# Altium schematic sheet HW_ITC_LE.SchDoc
size A2
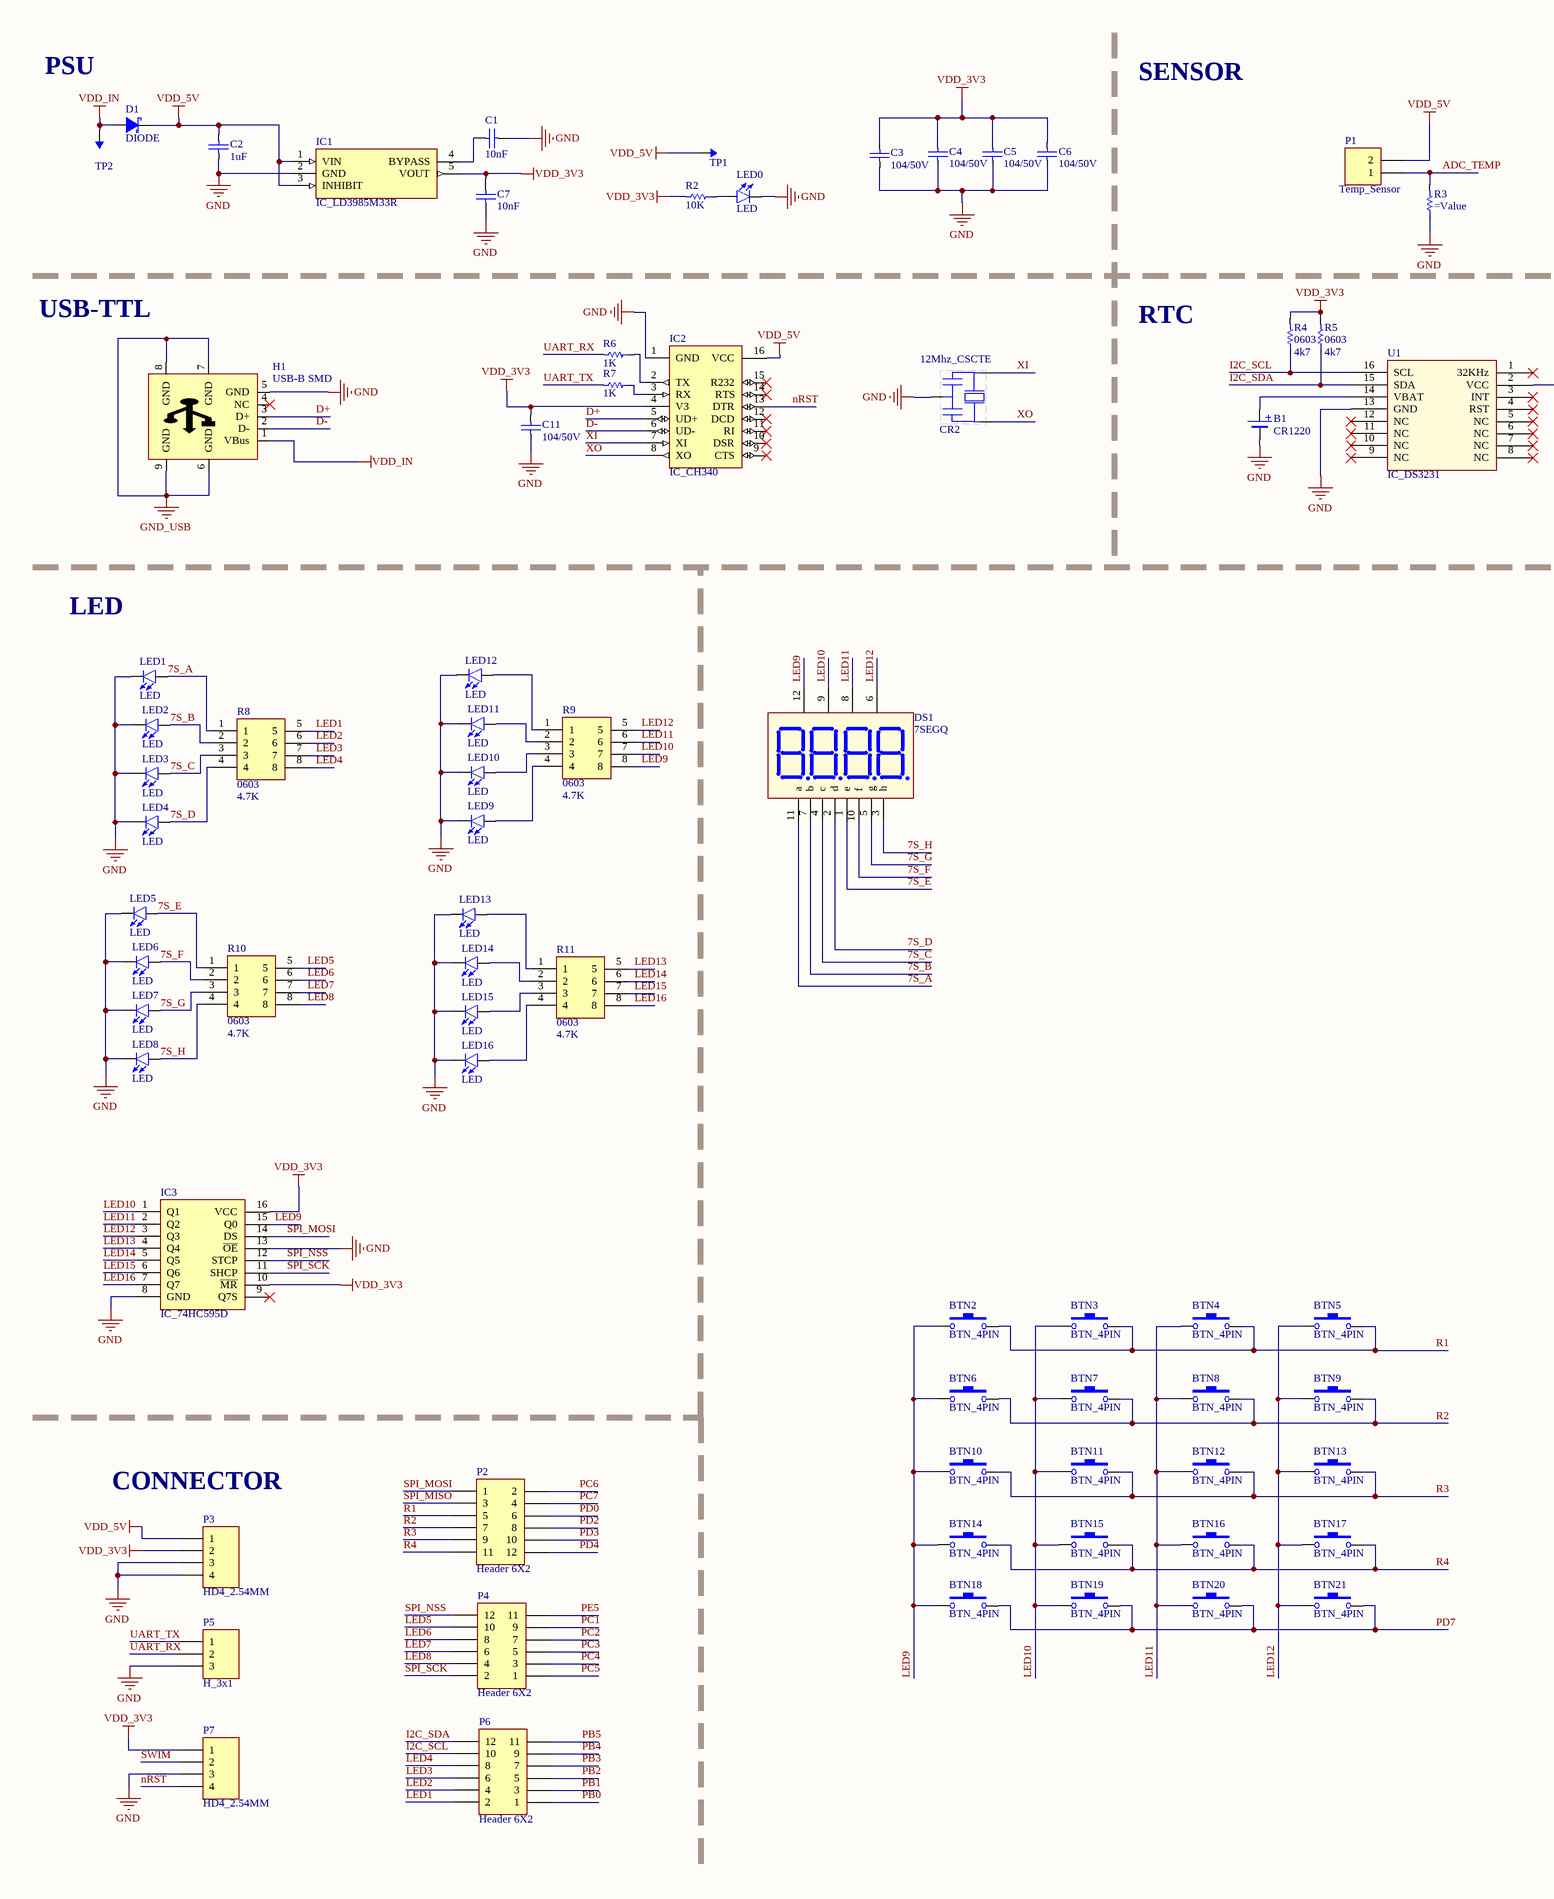
[diagram p0: HW_ITC_LE.SchDoc, left]
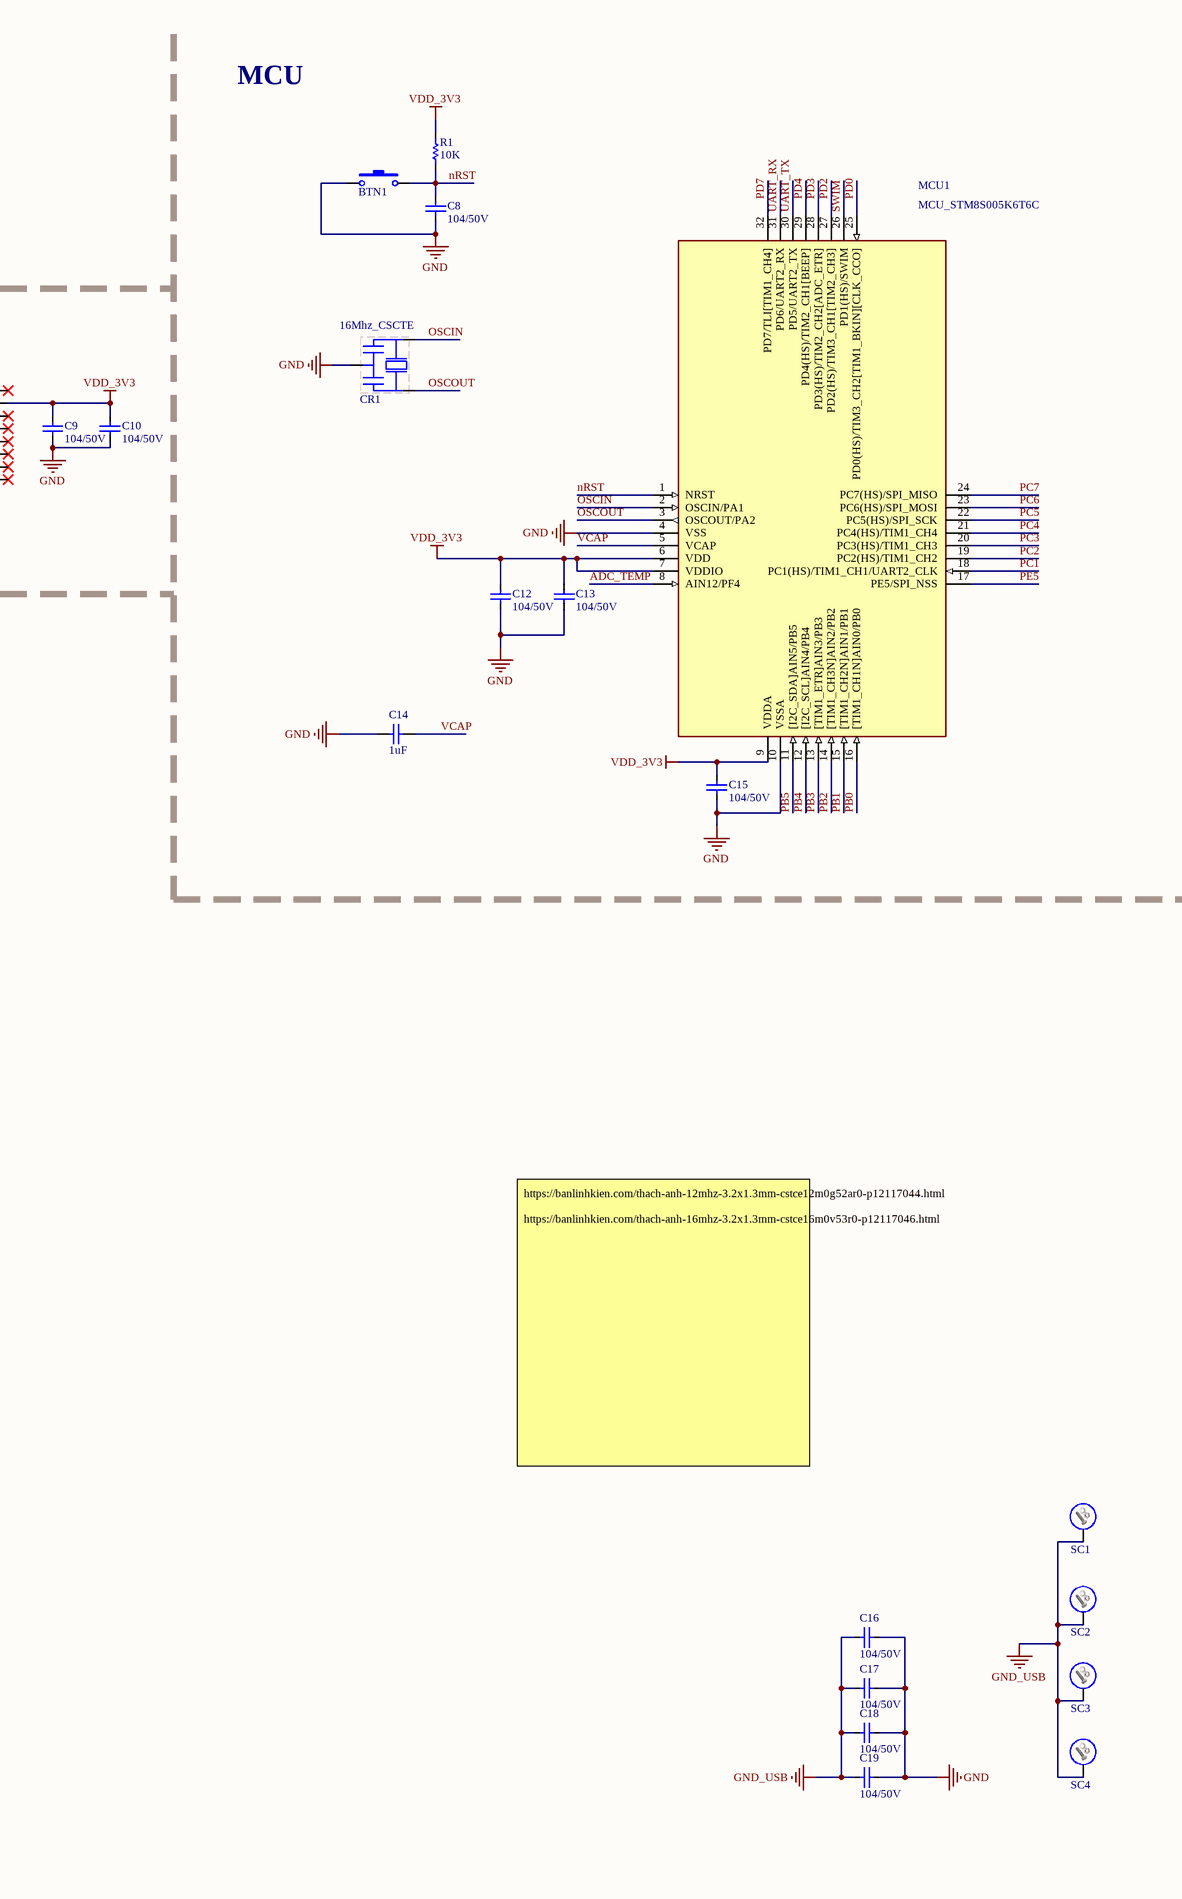
[diagram p1: HW_ITC_LE.SchDoc, right]

## Parts
B1  CR1220  [CR1220]
BTN1  EVQ-21307K  [BUTTON_2P_SMD]  (value not drawn)
BTN2  BTN_4PIN  [BTN_4PIN - 6X6mm]
BTN3  BTN_4PIN  [BTN_4PIN - 6X6mm]
BTN4  BTN_4PIN  [BTN_4PIN - 6X6mm]
BTN5  BTN_4PIN  [BTN_4PIN - 6X6mm]
BTN6  BTN_4PIN  [BTN_4PIN - 6X6mm]
BTN7  BTN_4PIN  [BTN_4PIN - 6X6mm]
BTN8  BTN_4PIN  [BTN_4PIN - 6X6mm]
BTN9  BTN_4PIN  [BTN_4PIN - 6X6mm]
BTN10  BTN_4PIN  [BTN_4PIN - 6X6mm]
BTN11  BTN_4PIN  [BTN_4PIN - 6X6mm]
BTN12  BTN_4PIN  [BTN_4PIN - 6X6mm]
BTN13  BTN_4PIN  [BTN_4PIN - 6X6mm]
BTN14  BTN_4PIN  [BTN_4PIN - 6X6mm]
BTN15  BTN_4PIN  [BTN_4PIN - 6X6mm]
BTN16  BTN_4PIN  [BTN_4PIN - 6X6mm]
BTN17  BTN_4PIN  [BTN_4PIN - 6X6mm]
BTN18  BTN_4PIN  [BTN_4PIN - 6X6mm]
BTN19  BTN_4PIN  [BTN_4PIN - 6X6mm]
BTN20  BTN_4PIN  [BTN_4PIN - 6X6mm]
BTN21  BTN_4PIN  [BTN_4PIN - 6X6mm]
C1  10nF  [C0603]
C2  1uF  [C0603]
C3  104/50V  [C0603]
C4  104/50V  [C0603]
C5  104/50V  [C0603]
C6  104/50V  [C0603]
C7  10nF  [C0603]
C8  104/50V  [C0603]
C9  104/50V  [C0603]
C10  104/50V  [C0603]
C11  104/50V  [C0603]
C12  104/50V  [C0603]
C13  104/50V  [C0603]
C14  1uF  [C0603]
C15  104/50V  [C0603]
C16  104/50V  [C0603]
C17  104/50V  [C0603]
C18  104/50V  [C0603]
C19  104/50V  [C0603]
CR1  16Mhz_CSCTE  [CRYSTAL_CSTCE_G_4520]
CR2  12Mhz_CSCTE  [CRYSTAL_CSTCE_G_4520]
D1  DIODE  [DIODE_SOD-123]
DS1  7SEGQ  [LED7SEG-4-0.36]
H1  USB-B SMD  [USB-B-Mini]
IC1  IC_LD3985M33R  [IC_LD3985M33R]
IC2  IC_CH340  [IC_CH340]
IC3  IC_74HC595D  [IC_74HC595]
LED0  LED  [LED_0805_BLUE]
LED1  LED  [LED_0805_BLUE]
LED2  LED  [LED_0805_BLUE]
LED3  LED  [LED_0805_BLUE]
LED4  LED  [LED_0805_BLUE]
LED5  LED  [LED_0805_BLUE]
LED6  LED  [LED_0805_BLUE]
LED7  LED  [LED_0805_BLUE]
LED8  LED  [LED_0805_BLUE]
LED9  LED  [LED_0805_BLUE]
LED10  LED  [LED_0805_BLUE]
LED11  LED  [LED_0805_BLUE]
LED12  LED  [LED_0805_BLUE]
LED13  LED  [LED_0805_BLUE]
LED14  LED  [LED_0805_BLUE]
LED15  LED  [LED_0805_BLUE]
LED16  LED  [LED_0805_BLUE]
MCU1  MCU_STM8S005K6T6C  [MCU_STM8S005K6T6C]
P1  Temp_Sensor  [H_2x1]
P2  Header 6X2  [HDR2X6]
P3  HD4_2.54MM  [HDR_2x2]
P4  Header 6X2  [HDR2X6]
P5  H_3x1  [HDR1X3]
P6  Header 6X2  [HDR2X6]
P7  HD4_2.54MM  [HDR4]
R1  10K  [R0603]
R2  10K  [R0603]
R3  (no value)  [R0603]
R4  Case Code - in: 0603  Resistance: 4k7  [R0603]  (hidden comment: R0603_4.7K_100mW_5%)
R5  Case Code - in: 0603  Resistance: 4k7  [R0603]  (hidden comment: R0603_4.7K_100mW_5%)
R6  1K  [R0603]
R7  1K  [R0603]
R8  Case/Package: 0603  Resistance: 4.7K  [R0603_4xArray]  (hidden comment: R0603_4.7Kohm_4xArray)
R9  Case/Package: 0603  Resistance: 4.7K  [R0603_4xArray]  (hidden comment: R0603_4.7Kohm_4xArray)
R10  Case/Package: 0603  Resistance: 4.7K  [R0603_4xArray]  (hidden comment: R0603_4.7Kohm_4xArray)
R11  Case/Package: 0603  Resistance: 4.7K  [R0603_4xArray]  (hidden comment: R0603_4.7Kohm_4xArray)
SC1  SCREW  [PAD_SCREW_3.2MM]  (value not drawn)
SC2  SCREW  [PAD_SCREW_3.2MM]  (value not drawn)
SC3  SCREW  [PAD_SCREW_3.2MM]  (value not drawn)
SC4  SCREW  [PAD_SCREW_3.2MM]  (value not drawn)
TP1  TESTPOINT  [TP-R40]  (value not drawn)
TP2  TESTPOINT  [TP-R40]  (value not drawn)
U1  IC_DS3231  [DS3231]

## Nets
GND: B1.2 BTN1.1 C1.2 C2.2 C3.2 C4.2 C5.2 C6.2 C7.1 C8.2 C9.2 C10.2 C11.2 C12.2 C13.2 C14.1 C15.1 C16.2 C17.2 C18.2 C19.2 CR1.2 CR2.2 H1.5(GND) IC1.2(GND) IC2.1(GND) IC3.8(GND) IC3.13(~{OE}) LED0.K LED1.K LED2.K LED3.K LED4.K LED5.K LED6.K LED7.K LED8.K LED9.K LED10.K LED11.K LED12.K LED13.K LED14.K LED15.K LED16.K MCU1.4(VSS) MCU1.10(VSSA) P3.3 P3.4 P5.3 P7.3 R3.1 U1.13(GND)
GND_USB: C16.1 C17.1 C18.1 C19.1 H1.6(GND) H1.7(GND) H1.8(GND) H1.9(GND) SC1.1 SC2.1 SC3.1 SC4.1
VDD_3V3: C3.1 C4.1 C5.1 C6.1 C7.2 C9.1 C10.1 C11.1 C12.1 C13.1 C15.2 IC1.5(VOUT) IC2.4(V3) IC3.10(~{MR}) IC3.16(VCC) MCU1.6(VDD) MCU1.7(VDDIO) MCU1.9(VDDA) P3.2 P7.1 R1.2 R2.2 R4.2 R5.2 U1.2(VCC)
VDD_5V: C2.1 D1.2(K) IC1.1(VIN) IC1.3(INHIBIT) IC2.16(VCC) P1.2 P3.1 TP1.1
VDD_IN: D1.1(A) H1.1(VBus) TP2.1
7S_A: DS1.11(a) LED1.A R8.1
7S_B: DS1.7(b) LED2.A R8.2
7S_C: DS1.4(c) LED3.A R8.3
7S_D: DS1.2(d) LED4.A R8.4
7S_E: DS1.1(e) LED5.A R10.1
7S_F: DS1.10(f) LED6.A R10.2
7S_G: DS1.5(g) LED7.A R10.3
7S_H: DS1.3(h) LED8.A R10.4
ADC_TEMP: MCU1.8(AIN12/PF4) P1.1 R3.2
D+: H1.3(D+) IC2.5(UD+)
D-: H1.2(D-) IC2.6(UD-)
I2C_SCL: P6.10 R4.1 U1.16(SCL)
I2C_SDA: P6.12 R5.1 U1.15(SDA)
LED1: P6.2 R8.5
LED2: P6.4 R8.6
LED3: P6.6 R8.7
LED4: P6.8 R8.8
LED5: P4.10 R10.5
LED6: P4.8 R10.6
LED7: P4.6 R10.7
LED8: P4.4 R10.8
LED9: BTN2.1 BTN6.1 BTN10.1 BTN14.1 BTN18.1 DS1.12(V1) IC3.15(Q0) R9.8
LED10: BTN3.1 BTN7.1 BTN11.1 BTN15.1 BTN19.1 DS1.9(V2) IC3.1(Q1) R9.7
LED11: BTN4.1 BTN8.1 BTN12.1 BTN16.1 BTN20.1 DS1.8(V3) IC3.2(Q2) R9.6
LED12: BTN5.1 BTN9.1 BTN13.1 BTN17.1 BTN21.1 DS1.6(V4) IC3.3(Q3) R9.5
LED13: IC3.4(Q4) R11.5
LED14: IC3.5(Q5) R11.6
LED15: IC3.6(Q6) R11.7
LED16: IC3.7(Q7) R11.8
nRST: BTN1.2 C8.1 IC2.13(DTR) MCU1.1(NRST) P7.4 R1.1
OSCIN: CR1.1 MCU1.2(OSCIN/PA1)
OSCOUT: CR1.3 MCU1.3(OSCOUT/PA2)
PB0: MCU1.16([TIM1_CH1N]AIN0/PB0) P6.1
PB1: MCU1.15([TIM1_CH2N]AIN1/PB1) P6.3
PB2: MCU1.14([TIM1_CH3N]AIN2/PB2) P6.5
PB3: MCU1.13([TIM1_ETR]AIN3/PB3) P6.7
PB4: MCU1.12([I2C_SCL]AIN4/PB4) P6.9
PB5: MCU1.11([I2C_SDA]AIN5/PB5) P6.11
PC1: MCU1.18(PC1(HS)/TIM1_CH1/UART2_CLK) P4.9
PC2: MCU1.19(PC2(HS)/TIM1_CH2) P4.7
PC3: MCU1.20(PC3(HS)/TIM1_CH3) P4.5
PC4: MCU1.21(PC4(HS)/TIM1_CH4) P4.3
PC5: MCU1.22(PC5(HS)/SPI_SCK) P4.1
PC6: MCU1.23(PC6(HS)/SPI_MOSI) P2.2
PC7: MCU1.24(PC7(HS)/SPI_MISO) P2.4
PD0: MCU1.25(PD0(HS)/TIM3_CH2[TIM1_BKIN][CLK_CCO]) P2.6
PD2: MCU1.27(PD2(HS)/TIM3_CH1[TIM2_CH3]) P2.8
PD3: MCU1.28(PD3(HS)/TIM2_CH2[ADC_ETR]) P2.10
PD4: MCU1.29(PD4(HS)/TIM2_CH1[BEEP]) P2.12
PD7: BTN18.2 BTN19.2 BTN20.2 BTN21.2 MCU1.32(PD7/TLI[TIM1_CH4])
PE5: MCU1.17(PE5/SPI_NSS) P4.11
R1: BTN2.2 BTN3.2 BTN4.2 BTN5.2 P2.5
R2: BTN6.2 BTN7.2 BTN8.2 BTN9.2 P2.7
R3: BTN10.2 BTN11.2 BTN12.2 BTN13.2 P2.9
R4: BTN14.2 BTN15.2 BTN16.2 BTN17.2 P2.11
SPI_MISO: P2.3
SPI_MOSI: IC3.14(DS) P2.1
SPI_NSS: IC3.12(STCP) P4.12
SPI_SCK: IC3.11(SHCP) P4.2
SWIM: MCU1.26(PD1(HS)/SWIM) P7.2
UART_RX: MCU1.31(PD6/UART2_RX) P5.2 R6.2
UART_TX: MCU1.30(PD5/UART2_TX) P5.1 R7.2
VCAP: C14.2 MCU1.5(VCAP)
XI: CR2.1 IC2.7(XI)
XO: CR2.3 IC2.8(XO)
NetB1_1: B1.1 U1.14(VBAT)
NetC1_1: C1.1 IC1.4(BYPASS)
NetIC2_2: IC2.2(TX) R6.1
NetIC2_3: IC2.3(RX) R7.1
NetLED0_A: LED0.A R2.1
NetLED9_A: LED9.A R9.4
NetLED10_A: LED10.A R9.3
NetLED11_A: LED11.A R9.2
NetLED12_A: LED12.A R9.1
NetLED13_A: LED13.A R11.1
NetLED14_A: LED14.A R11.2
NetLED15_A: LED15.A R11.3
NetLED16_A: LED16.A R11.4

Not connected (* = marked no-connect by the designer): H1 4(NC)*; IC2 9(CTS)* 10(DSR)* 11(RI)* 12(DCD)* 14(RTS)* 15(R232)*; IC3 9(Q7S)*; U1 1(32KHz)* 3(INT)* 4(RST)* 5(NC)* 6(NC)* 7(NC)* 8(NC)* 9(NC)* 10(NC)* 11(NC)* 12(NC)*

## Notes on the sheet
- PSU
- SENSOR
- MCU
- USB-TTL
- RTC
- LED
- https://banlinhkien.com/thach-anh-12mhz-3.2x1.3mm-cstce12m0g52ar0-p12117044.html
  https://banlinhkien.com/thach-anh-16mhz-3.2x1.3mm-cstce16m0v53r0-p12117046.html
- (near P3) CONNECTOR

## Library data of the parts
B1 = Battery_CR1220
BTN1 = BTN_2P_SMD: PANASONIC   EVQ-21307K   SWITCH, TACTILE, SPST-NO, 20mA, 15VDC; Actuator Color: Black; Maximum DC Voltage Rating: 15 V; Pole Throw Configuration: SPST; Switch Configuration: N.O.; Illumination Type: N/R; Ground Terminal: No; Electrical Life: 100000 Cycles; Body Orientation: Straight; Actuator Length: 3.6 mm; Maximum Contact Resistance: 50 mOhm; Operating Force: 1 N; Actuator Style: Round Button; Dielectric Strength: 250 VAC; Contact Rating @ Voltage: 0.02@15VDC A; COO: MY; Capacitance: 10 µF; Dielectric: X5R; Tolerance (%): ±10 %; Rated Voltage: 6.3 V; Manufacturer: Panasonic; Manufacturer Part Number: EVQ-21307K; Part No: EVQ-21307K; RoHS: Yes; Supplier Standard Pack: 1,000; Type: Light Touch; Maximum AC Voltage Rating: N/A; Family: EVQ2; Contact Material: N/A; Seal Description: N/A; Mechanical Life: N/A; Packaging: Radial Tape and Reel; Contact Plating: N/A; Housing Material: N/A; Product Weight: N/A; Base Material: N/A; Mounting: Through Hole,PC Pins; Seal Location: N/A; Minimum Insulation Resistance: 50 MOhm; Operating Temperature: -20 to 70 C; Dimension: 6 x 6 x 7 mm; HTS: 8536509020; ECCN: EAR99; ComponentLink1URL: https://industrial.panasonic.com/ac/e_download/control/switch/light-touch/catalog/sw_lt_eng_5n_2r.pdf?src-supplier=Digi-Key; ComponentLink1Description: https://industrial.panasonic.com/ac/e_download/control/switch/light-touch/catalog/sw_lt_eng_5n_2r.pdf?src-supplier=Digi-Key; ComponentLink2URL: http://industrial.panasonic.com/www-data/pdf/ATK0000/ATK0000CE33.pdf?src-supplier=Future+Electronics; ComponentLink2Description: http://industrial.panasonic.com/www-data/pdf/ATK0000/ATK0000CE33.pdf?src-supplier=Future+Electronics; ComponentLink3URL: https://www.alliedelec.com/m/d/c6165424a4b5cbcf56af329b1c3386ad.pdf?src-supplier=Allied+Electronics; ComponentLink3Description: https://www.alliedelec.com/m/d/c6165424a4b5cbcf56af329b1c3386ad.pdf?src-supplier=Allied+Electronics; ComponentLink4URL: http://industrial.panasonic.com/www-data/pdf/ATK0000/ATK0000CE33.pdf?src-supplier=Avnet; ComponentLink4Description: http://industrial.panasonic.com/www-data/pdf/ATK0000/ATK0000CE33.pdf?src-supplier=Avnet; Supplier 1: Digi-Key; Supplier Part Number 1: CKN10384TR-ND; Supplier 2: Digi-Key; Stock 2: 264507; Pricing 2: 1=0.22, 10=0.148, 100=0.0751, 500=0.0514, 1000=0.0455 (USD); Case Size/Dimension: 1206; ComponentLink5URL: https://www.verical.com/server-webapp/html/getDatasheet?partID=357469&src-supplier=Verical; ComponentLink5Description: https://www.verical.com/server-webapp/html/getDatasheet?partID=357469&src-supplier=Verical; ComponentLink6URL: http://www.samsungsem.com/kr/support/product-search/mlcc/CL31A106KQHNNNE.jsp?src-supplier=Digi-Key; ComponentLink6Description: http://www.samsungsem.com/kr/support/product-search/mlcc/CL31A106KQHNNNE.jsp?src-supplier=Digi-Key; ComponentLink7URL: http://www1.futureelectronics.com/doc/SAMSUNG%20PASSIVE/CL05B104KQ5NNNC.pdf?src-supplier=Future+Electronics; ComponentLink7Description: http://www1.futureelectronics.com/doc/SAMSUNG%20PASSIVE/CL05B104KQ5NNNC.pdf?src-supplier=Future+Electronics; Supplier Part Number 2: 1276-1079-1-ND
C1 C7 C14 = Capacitor - non polarized: Non-polarised capacitor
C2-C6 C8-C13 C15-C19 = C0603_104_50V: CAP-CER-104-50V-0603-10%; Manufacturer: Samsung; Manufacturer Part Number: CL10B104KB8NNNC; Capacitance: 0.1 µF; Dielectric: X7R; Tolerance (%): ±10 %; Rated Voltage: 50 V; Supplier 1: Digi-Key; Stock 1: 5780545; Pricing 1: 1=0.1, 10=0.033, 100=0.0148, 500=0.0105, 1000=0.0083 (USD); Case Size/Dimension: 0603; ComponentLink1URL: http://www.samsungsem.com/kr/support/product-search/mlcc/CL10B104KB8NNNC.jsp?src-supplier=Digi-Key; ComponentLink1Description: http://www.samsungsem.com/kr/support/product-search/mlcc/CL10B104KB8NNNC.jsp?src-supplier=Digi-Key; ComponentLink2URL: https://www.verical.com/server-webapp/html/getDatasheet?partID=89097&src-supplier=Verical; ComponentLink2Description: https://www.verical.com/server-webapp/html/getDatasheet?partID=89097&src-supplier=Verical; ComponentLink3URL: https://produktinfo.conrad.com/datenblaetter/450000-474999/456651-da-01-en-VS_KONDENSATOR_0605.pdf?src-supplier=Conrad; ComponentLink3Description: https://produktinfo.conrad.com/datenblaetter/450000-474999/456651-da-01-en-VS_KONDENSATOR_0605.pdf?src-supplier=Conrad; Supplier Part Number 1: 1276-1000-1-ND
CR1 CR2 = CR_6Mhz_CSCTE: CER RES 6Mhz SMD
D1 = DIODE_SOD-123FL: Schottky Diode RB060MM-60TFTR; Manufacturer_Name: ROHM Semiconductor; Datasheet Link: https://www.rohm.com/datasheet/RB060MM-60/rb060mm-60tr-e; Height: 0.9mm; Manufacturer_Part_Number: RB060MM-60TFTR; Mouser Part Number: 755-RB060MM-60TFTR; Mouser Price/Stock: https://www.mouser.com/Search/Refine.aspx?Keyword=755-RB060MM-60TFTR
DS1 = LED7SEG-4: Four 7 Seg Dipslay; Value: LED 7Q SEG
IC1 = IC_LD3985M33R: Integrated Circuit; Manufacturer_Name: STMicroelectronics; Allied_Number: 70390246; Datasheet Link: http://www.st.com/st-web-ui/static/active/en/resource/technical/document/datasheet/CD00003395.pdf; Height: 1.45mm; Manufacturer_Part_Number: LD3985M33R; Mouser Part Number: 511-LD3985M33R; Mouser Price/Stock: https://www.mouser.com/Search/Refine.aspx?Keyword=511-LD3985M33R; RS Part Number: 6868802P; RS Price/Stock: http://uk.rs-online.com/web/p/products/6868802P; Allied Price/Stock: http://www.alliedelec.com/stmicroelectronics-ld3985m33r/70390246/
IC2 = IC_CH340: Circuit Breaker Magnetic 3Pole 40A 240VAC; MF: Eaton; MP: CH340; Availability: Unavailable; Price: None; Package: None; Value: *; SnapEDA_Link: https://www.snapeda.com/parts/CH340/Eaton/view-part/4701946/?ref=snap
IC3 = IC_74HC595D: Integrated Circuit; Manufacturer_Name: Nexperia; Datasheet Link: https://componentsearchengine.com/Datasheets/2/74HC595D.pdf; Height: 1.75mm; Manufacturer_Part_Number: 74HC595D; Mouser Part Number: N/A; Mouser Price/Stock: https://www.mouser.com/Search/Refine.aspx?Keyword=N%2FA
LED0-LED16 = LED_0805: Supplier 1: Allied Electronics; Supplier Part Number 1: 70081993
MCU1 = MCU_STM8S005K6T6C: Integrated Circuit; Manufacturer_Name: STMicroelectronics; Allied_Number: 70521201; Datasheet Link: http://www.st.com/web/en/resource/technical/document/datasheet/DM00037613.pdf; Height: 1.6mm; Manufacturer_Part_Number: STM8S005K6T6C; Mouser Part Number: 511-STM8S005K6T6C; Mouser Price/Stock: https://www.mouser.com/Search/Refine.aspx?Keyword=511-STM8S005K6T6C; RS Part Number: 8107405P; RS Price/Stock: http://uk.rs-online.com/web/p/products/8107405P; Allied Price/Stock: http://www.alliedelec.com/stmicroelectronics-stm8s005k6t6c/70521201/
P1 = HD2_WHITE_2.54MM: HEADER_2POS 2.54MM; Manufacturer: AMP - TE CONNECTIVITY; Manufacturer Part Number: 640456-2; Supplier 1: Digi-Key; Stock 1: 147886; Pricing 1: 1=0.11, 10=0.107, 100=0.0663, 500=0.0549, 1000=0.048, 5000=0.0411, 10000=0.04 (USD); Supplier Part Number 1: A1921-ND
P3 P7 = HD4_2.54MM: HEADER_4POS 2.54MM; Manufacturer: AMP - TE CONNECTIVITY; Manufacturer Part Number: 640456-4; Supplier 1: Digi-Key; Stock 1: 93200; Pricing 1: 1=0.21, 10=0.195, 100=0.1353, 500=0.1144, 1000=0.0936, 5000=0.0832, 10000=0.0754 (USD); Supplier Part Number 1: A1922-ND
P5 = J_3x1: Header, 3-Pin; LatestRevisionDate: 17-Jul-2002; LatestRevisionNote: Re-released for DXP Platform.; Publisher: Altium Limited
R1 R2 = R0603_103_1/16W: RES SMD 10K OHM 0.5% 1/16W 0603; Manufacturer: Susumu; Manufacturer Part Number: RR0816P-103-D; Resistance: 10 kOhms; Power Rating: 62.5 mW (1/16 W); Temperature Coefficient: 25 PPM / C; Voltage Rating: 75 V; Unit Weight: 0.000071 oz; Supplier 1: Digi-Key; Stock 1: 1518536; Pricing 1: 1=0.11, 10=0.098, 100=0.0376, 1000=0.0165, 2500=0.0143 (USD); Product Category: Thin Film Resistors; RoHS: True; Tolerance: 0.5 %; Case Code - in: 0603; Case Code - mm: 1608; Operating Temperature Range: - 55 C to + 125 C; Packaging: Reel; Brand: Susumu; Height: 0.4 mm; Length: 1.6 mm; Package / Case: 0603 (1608 metric); Product: Thin Film Resistors SMD; Termination Style: SMD/SMT; Width: 0.8 mm; ComponentLink1URL: http://documents.rs-components.com/techlib://itc_doclist_GB.htm?stockno=3915321&src-supplier=RSComponents; ComponentLink1Description: http://documents.rs-components.com/techlib://itc_doclist_GB.htm?stockno=3915321&src-supplier=RSComponents; ComponentLink2URL: http://www.susumu.co.jp/common/pdf/n_catalog_partition05_en.pdf?src-supplier=Digi-Key; ComponentLink2Description: http://www.susumu.co.jp/common/pdf/n_catalog_partition05_en.pdf?src-supplier=Digi-Key; Supplier Part Number 1: RR08P10.0KDCT-ND
R3 R6 R7 = Resistor - 5%
R4 R5 = R0603_4.7K_100mW_5%: RES SMD 4.7k OHM 5% 100mW; Manufacturer: Yageo; Manufacturer Part Number: RC0603JR-074K7L; Voltage Rating: 50 V; Temperature Coefficient: 100 PPM / C; Voltage Rating (DC): 75V; Supplier 1: Digi-Key; Stock 1: 18904298; Pricing 1: 1=0.1, 10=0.02, 100=0.0081, 1000=0.0036, 2500=0.0031 (USD); Termination Style: SMD/SMT; Product: Thick Film Resistors General Purpose; Tolerance: 5 %; Power Rating: 100 mW; Case Code - mm: 1608; Series: RC; Operating Temperature Range: - 55 C to + 155 C; Packaging: Reel; ComponentLink1URL: http://www.farnell.com/datasheets/443971.pdf?src-supplier=Element14; ComponentLink1Description: http://www.farnell.com/datasheets/443971.pdf?src-supplier=Element14; Supplier Part Number 1: 311-4.7KGRCT-ND; Supplier 2: Digi-Key; Stock 2: 700395; Pricing 2: 1=0.1, 10=0.065, 100=0.0264, 1000=0.0119, 2500=0.0103 (USD); Mount: Surface Mount; Case/Package: 0603; Case Code (Metric): 1608; Case Code (Imperial): 0603; Contact Plating: Tin; Min Operating Temperature: -55°C; Max Operating Temperature: 155°C; Composition: Thick Film; Number of Terminations: 2; Package Quantity: 1; Termination: SMD/SMT; Max Power Dissipation: 100mW; Features: Automotive AEC-Q200; Military Standard: Not; Length: 1.6mm; Height: 0.022inch; Width: 0.031inch; Depth: 0.8mm; Radiation Hardening: No; Lead Free: Lead Free; REACH SVHC: No SVHC; ComponentLink2URL: http://www.farnell.com/datasheets/1678782.pdf?src-supplier=Element14; ComponentLink2Description: http://www.farnell.com/datasheets/1678782.pdf?src-supplier=Element14; ComponentLink3URL: http://www.farnell.com/datasheets/426256.pdf?src-supplier=Element14; ComponentLink3Description: http://www.farnell.com/datasheets/426256.pdf?src-supplier=Element14; ComponentLink4URL: http://www.mouser.com/ds/2/315/AOA0000CE2-37512.pdf?src-supplier=Mouser; ComponentLink4Description: http://www.mouser.com/ds/2/315/AOA0000CE2-37512.pdf?src-supplier=Mouser; ComponentLink5URL: http://industrial.panasonic.com/www-data/pdf/AOA0000/AOA0000CE2.pdf?src-supplier=Avnet; ComponentLink5Description: http://industrial.panasonic.com/www-data/pdf/AOA0000/AOA0000CE2.pdf?src-supplier=Avnet; ComponentLink6URL: http://industrial.panasonic.com/www-data/pdf/AOA0000/AOA0000CE2.pdf?src-supplier=Element14; ComponentLink6Description: http://industrial.panasonic.com/www-data/pdf/AOA0000/AOA0000CE2.pdf?src-supplier=Element14; ComponentLink7URL: http://www.farnell.com/datasheets/1911175.pdf?src-supplier=Element14; ComponentLink7Description: http://www.farnell.com/datasheets/1911175.pdf?src-supplier=Element14; ComponentLink8URL: http://www.alliedelec.com/m/d/623f45ff1957d936ff56d46fd1c28cac.pdf?src-supplier=Allied+Electronics; ComponentLink8Description: http://www.alliedelec.com/m/d/623f45ff1957d936ff56d46fd1c28cac.pdf?src-supplier=Allied+Electronics
R8-R11 = R0603_4.7Kohm_4xArray: RES ARRAY 2 RES 4.7K OHM 0603; Manufacturer: CTS; Manufacturer Part Number: 742C043220JP; Tolerance: 5%; Temperature Coefficient: 200ppm/°C; Power Rating: 125mW; Circuit Type: Isolated; Number of Resistors: 2; Power Per Element: 62.5mW; Supplier 1: Arrow; Stock 1: 5000; Pricing 1: 1=0.19, 10=0.1587, 25=0.1151, 100=0.039, 250=0.0351, 500=0.0316, 1000=0.0247, 3000=0.0241 (USD); Mount: Surface Mount; Number of Pins: 4; Case Code (Imperial): 0603; Contact Plating: Tin,Matte; Min Operating Temperature: -55°C; Max Operating Temperature: 125°C; Packaging: Tape and Reel; Package Quantity: 1; Termination: SMD/SMT; Length: 0.063inch; Height: 0.028inch; Width: 0.063inch; Terminal Pitch: 0.8mm; Lead Free: Lead Free; ComponentLink1URL: https://media.digikey.com/pdf/Data%20Sheets/CTS%20Corporation%20PDFs/741%20to%20746%20Series%20Resistor%20Chip%20Arrays.pdf?src-supplier=Digi-Key; ComponentLink1Description: https://media.digikey.com/pdf/Data%20Sheets/CTS%20Corporation%20PDFs/741%20to%20746%20Series%20Resistor%20Chip%20Arrays.pdf?src-supplier=Digi-Key; ComponentLink2URL: http://www.ctscorp.com/wp-content/uploads/74x.pdf?src-supplier=Digi-Key; ComponentLink2Description: http://www.ctscorp.com/wp-content/uploads/74x.pdf?src-supplier=Digi-Key; Supplier Part Number 1: 742C043220JP
U1 = IC_DS3231: IC RTC CLK/CALENDAR I2C 16-SOIC
BTN2-BTN21 = BTN_4PIN: Published: 24-Mar-1999; LatestRevisionDate: 17-Jul-2002; LatestRevisionNote: Re-released for DXP Platform.; PackageReference: SPST-2; Publisher: Altium Limited
H1 = USB-B SMD: Supplier 1: Digi-Key; Supplier Part Number 1: 151-1206-1-ND
P2 P4 P6 = Header 6X2: LatestRevisionDate: 17-Jul-2002; LatestRevisionNote: Re-released for DXP Platform.; Publisher: Altium Limited
SC1-SC4 = SCREW: Value: SCREW